# EAGLE schematic SMD_Hardware_V0.1 (EAGLE 7.6.0)
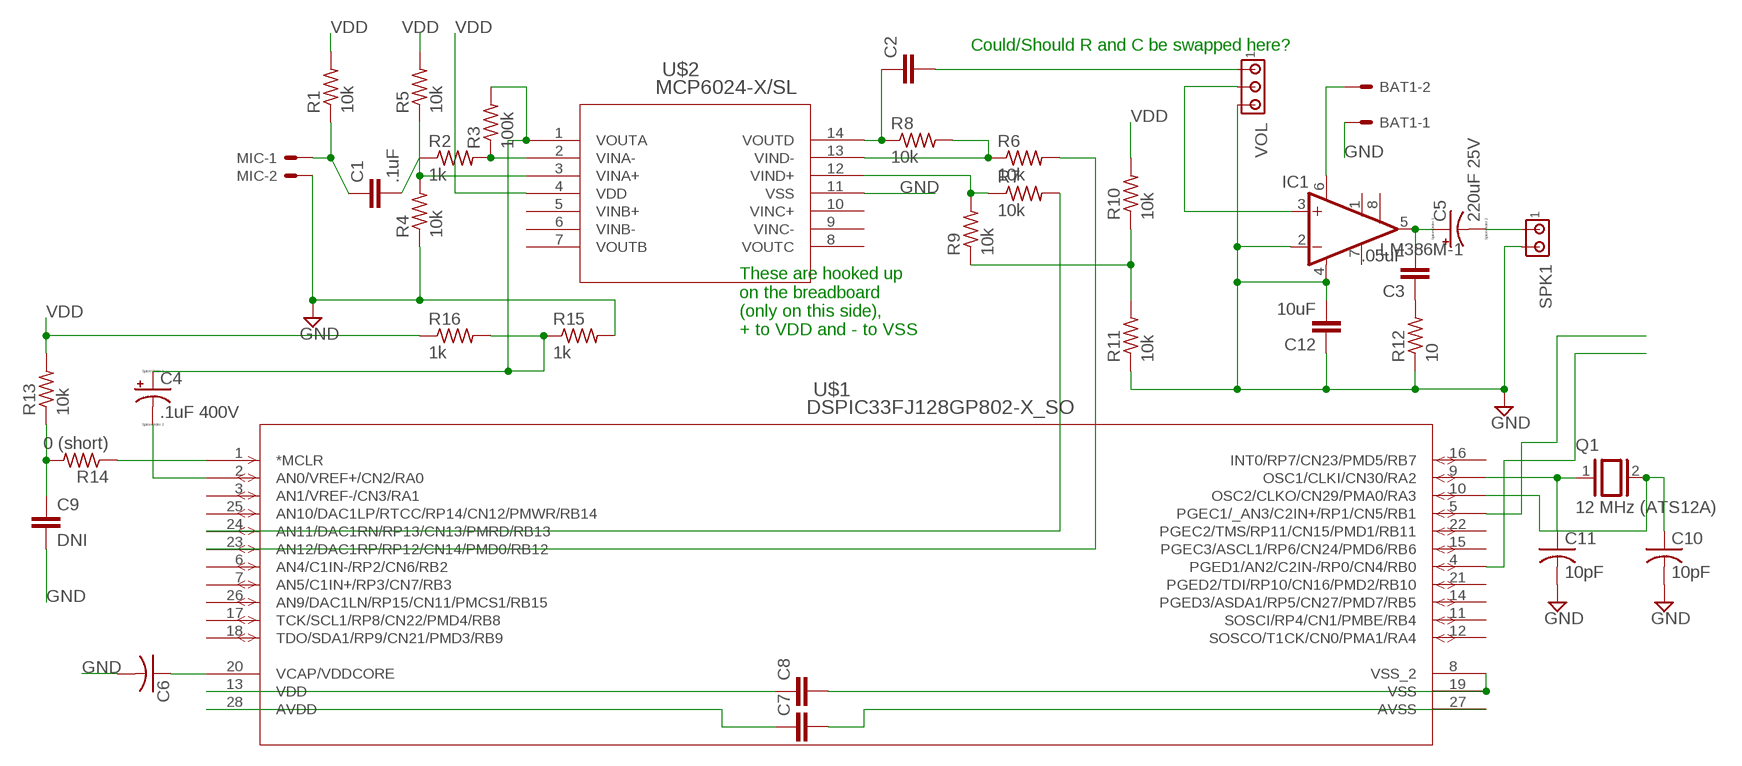
[diagram p0: schematic, sheet 1]

## Parts
BAT1  22-23-2021  [22-23-2021]
C1  .1uF  C-EUC0603  [C0603]
C2  C-EUC0603  [C0603]
C3  .05uF  C-EUC0603  [C0603]
C4  .1uF 400V  CPOL-US140CLH-0810  [140CLH-0810]
C5  220uF 25V  CPOL-US140CLH-0810  [140CLH-0810]
C6  C-USC0805  [C0805]
C7  C-EUC0805  [C0805]
C8  C-EUC0805  [C0805]
C9  DNI  C-EUC0805  [C0805]
C10  10pF  C-US025-024X044  [C025-024X044]
C11  10pF  C-US025-024X044  [C025-024X044]
C12  10uF  C-EUC0603  [C0603]
IC1  LM386M-1  [SO08]
MIC  22-23-2021  [22-23-2021]
Q1  12 MHz (ATS12A)  XTAL  [Q]
R1  10k  R-US_R0603  [R0603]
R2  1k  R-US_R0603  [R0603]
R3  100k  R-US_R0603  [R0603]
R4  10k  R-US_R0603  [R0603]
R5  10k  R-US_R0603  [R0603]
R6  10k  R-US_R0603  [R0603]
R7  10k  R-US_R0603  [R0603]
R8  10k  R-US_R0603  [R0603]
R9  10k  R-US_R0603  [R0603]
R10  10k  R-US_R0603  [R0603]
R11  10k  R-US_R0603  [R0603]
R12  10  R-US_R0603  [R0603]
R13  10k  R-US_R0603  [R0603]
R14  0 (short)  R-US_R0603  [R0603]
R15  1k  R-US_R0603  [R0603]
R16  1k  R-US_R0603  [R0603]
SPK1  MTA02-100  [10X02MTA]
U$1  DSPIC33FJ128GP802-X_SO  [SOIC28-W_MC]
U$2  MCP6024-X/SL  [SOIC14-N_MC]
VOL  MTA03-100  [10X03MTA]

## Nets
GND: BAT1.1 C6.2 C9.2 C10.2 C11.2 C12.1 C12.2 IC1.2(-IN) IC1.4(GND) MIC.2 R4.1 R11.1 R12.1 R15.2 SPK1.2 U$2.11(VSS) VOL.3
N$1: C1.1 MIC.1 R1.1
N$2: C1.2 R2.1
N$3: R2.2 R3.1 U$2.2(VINA-)
N$4: R4.2 R5.1 U$2.3(VINA+)
N$5: R9.1 R10.1 R11.2
N$6: U$1.5(PGEC1/_AN3/C2IN+/RP1/CN5/RB1)
N$7: C2.1 R8.1 U$2.14(VOUTD)
N$8: R6.1 R8.2 U$2.13(VIND-)
N$9: R7.2 U$1.24(AN11/DAC1RN/RP13/CN13/PMRD/RB13)
N$10: R7.1 R9.2 U$2.12(VIND+)
N$11: R6.2 U$1.23(AN12/DAC1RP/RP12/CN14/PMD0/RB12)
N$12: C4.- U$1.2(AN0/VREF+/CN2/RA0)
N$13: BAT1.2 IC1.6(VS)
N$14: C2.2 VOL.1
N$15: C3.2 C5.+ IC1.5(OUT)
N$16: C3.1 R12.2
N$17: C5.- SPK1.1
N$18: C6.1 U$1.20(VCAP/VDDCORE)
N$19: C8.1 U$1.13(VDD)
N$20: C8.2 U$1.8(VSS_2) U$1.19(VSS)
N$21: C7.1 U$1.28(AVDD)
N$22: C7.2 U$1.27(AVSS)
N$23: C9.1 R13.1 R14.2
N$24: R14.1 U$1.1(*MCLR)
N$25: IC1.3(+IN) VOL.2
N$26: C4.+ R3.2 R15.1 R16.2 U$2.1(VOUTA)
N$27: U$1.4(PGED1/AN2/C2IN-/RP0/CN4/RB0)
N$28: C11.1 Q1.1 U$1.9(OSC1/CLKI/CN30/RA2)
N$29: C10.1 Q1.2 U$1.10(OSC2/CLKO/CN29/PMA0/RA3)
VDD: R1.2 R5.2 R10.2 R13.2 R16.1 U$2.4(VDD)
Unconnected: IC1.1(GAIN) IC1.7(BYPASS) IC1.8(GAIN) U$1.3(AN1/VREF-/CN3/RA1) U$1.6(AN4/C1IN-/RP2/CN6/RB2) U$1.7(AN5/C1IN+/RP3/CN7/RB3) U$1.11(SOSCI/RP4/CN1/PMBE/RB4) U$1.12(SOSCO/T1CK/CN0/PMA1/RA4) U$1.14(PGED3/ASDA1/RP5/CN27/PMD7/RB5) U$1.15(PGEC3/ASCL1/RP6/CN24/PMD6/RB6) U$1.16(INT0/RP7/CN23/PMD5/RB7) U$1.17(TCK/SCL1/RP8/CN22/PMD4/RB8) U$1.18(TDO/SDA1/RP9/CN21/PMD3/RB9) U$1.21(PGED2/TDI/RP10/CN16/PMD2/RB10) U$1.22(PGEC2/TMS/RP11/CN15/PMD1/RB11) U$1.25(AN10/DAC1LP/RTCC/RP14/CN12/PMWR/RB14) U$1.26(AN9/DAC1LN/RP15/CN11/PMCS1/RB15) U$2.5(VINB+) U$2.6(VINB-) U$2.7(VOUTB) U$2.8(VOUTC) U$2.9(VINC-) U$2.10(VINC+)

## Notes on the sheet
- Could/Should R and C be swapped here?
- These are hooked up 
  on the breadboard 
  (only on this side), 
  + to VDD and - to VSS

## Library data of the parts
BAT1 MIC = con-molex:22-23-2021: .100" (2.54mm) Center Header - 2 Pin; MF: MOLEX; MPN: 22-23-2021; OC_FARNELL: 1462926; OC_NEWARK: 25C3832
C1-C3 C7-C9 C12 = resistor:C-EU: CAPACITOR, European symbol
C4 C5 = resistor:CPOL-US: POLARIZED CAPACITOR, American symbol
C6 C10 C11 = resistor:C-US: CAPACITOR, American symbol
IC1 = linear:LM386?-*: Low Voltage Audio Power Amplifier Source: http://cache.national.com/ds/LM/LM386.pdf
Q1 = special:XTAL: CRYSTAL
R1-R16 = resistor:R-US_: RESISTOR, American symbol
SPK1 = con-amp:MTA02-100: AMP connector
U$1 = Microchip_DSP:DSPIC33FJ128GP802-X_SO
U$2 = Microchip_DSP:MCP6024-X/SL
VOL = con-amp:MTA03-100: AMP connector